# Altium schematic sheet -NEW_AQB-5-ANTON_TRANS-PWR-TVS.SchDoc
size B; Organization: AQRONOS; Address1: 12789 Emerson St.; Address2: Thornton, CO  80021; Address3: USA
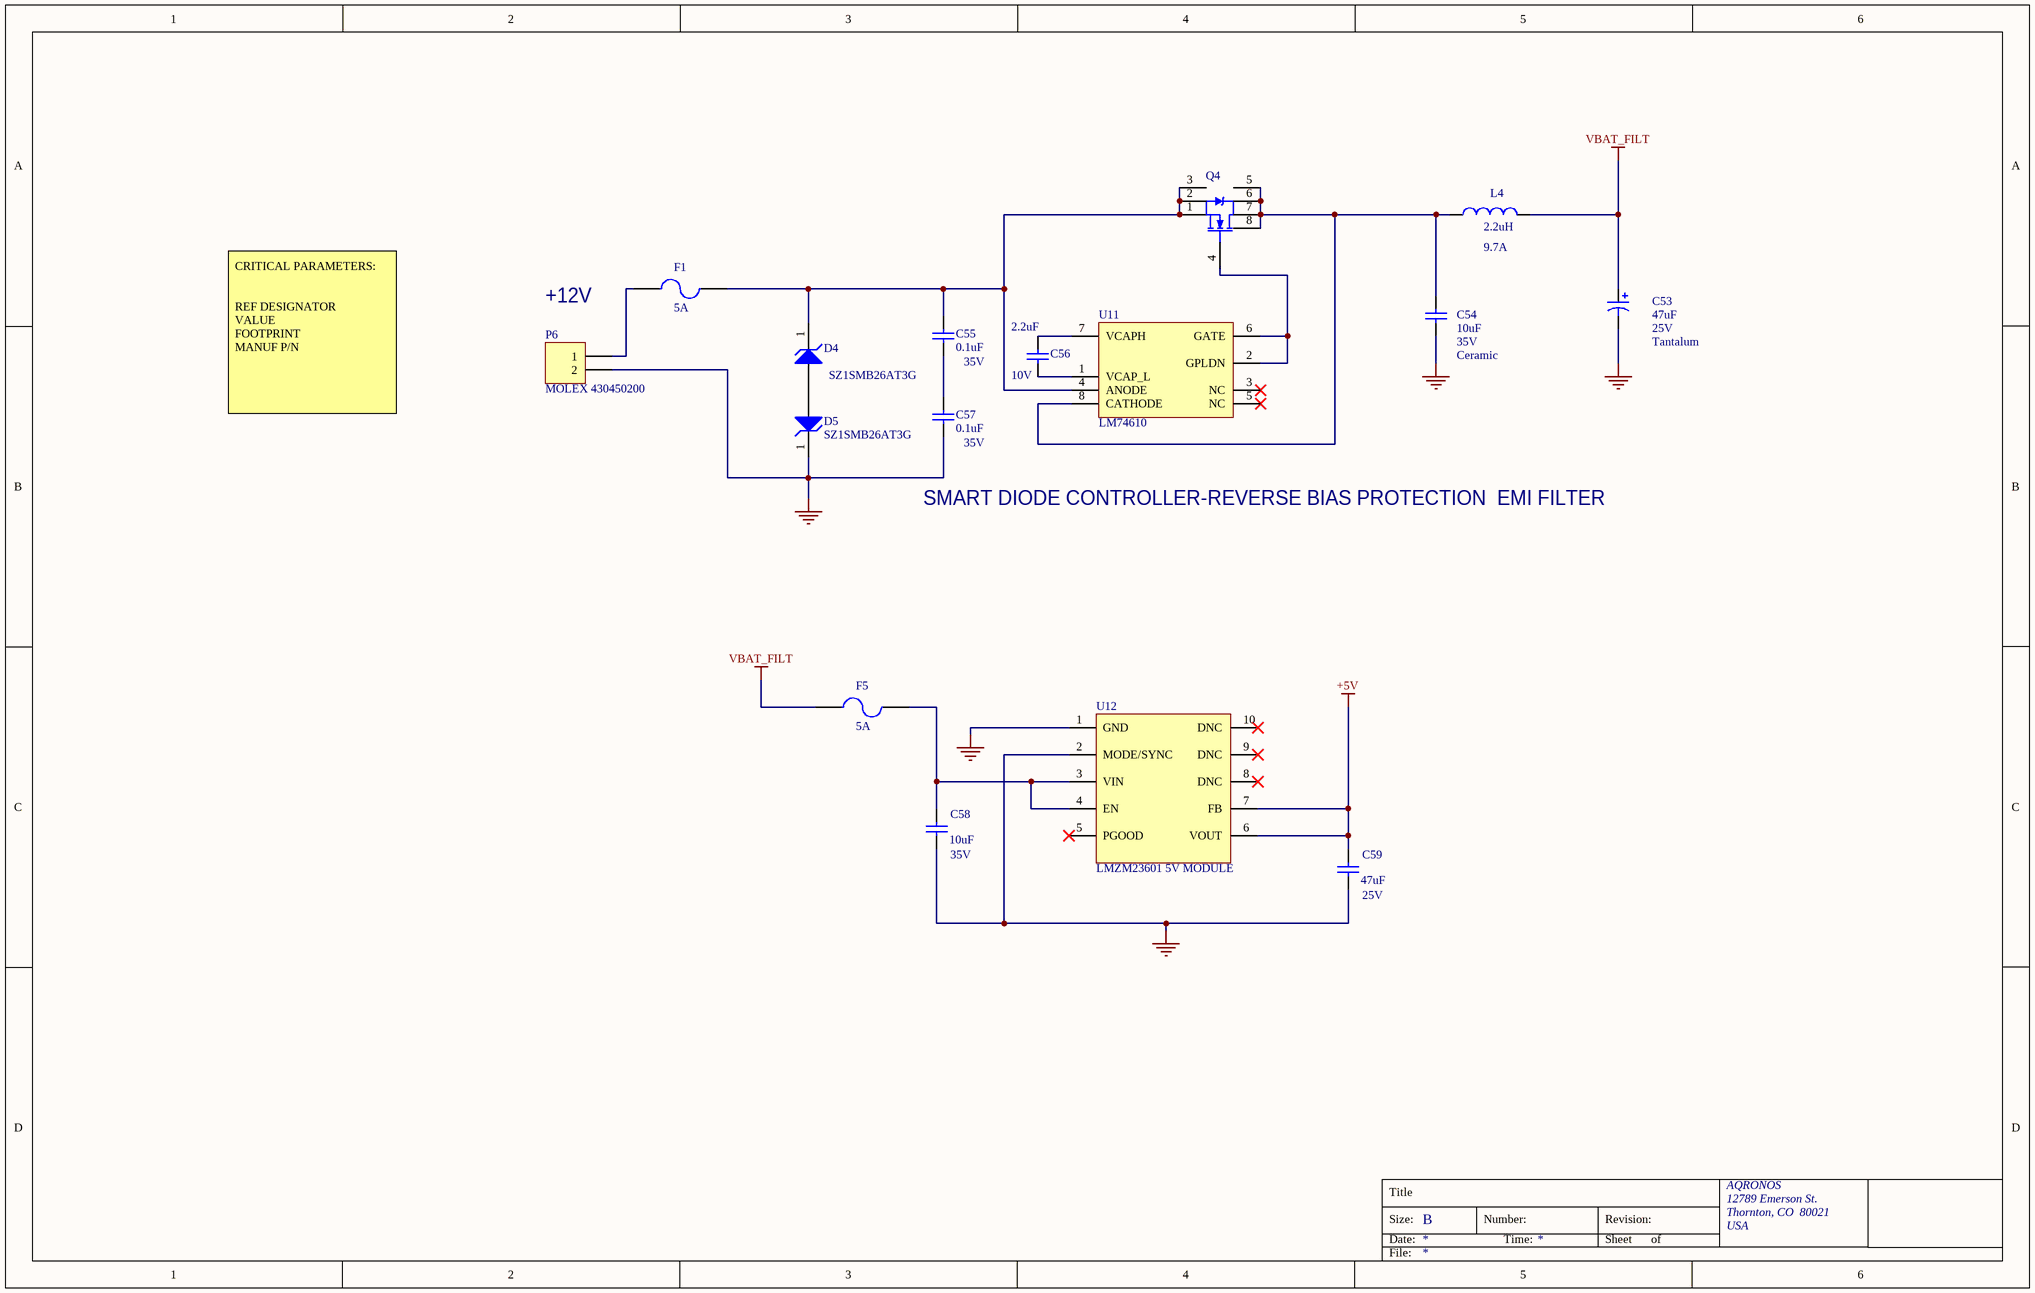
[diagram p0: -NEW_AQB-5-ANTON_TRANS-PWR-TVS.SchDoc]

## Parts
C53  Tantalum  value 47uF  Voltage: 25V  [C2917]
C54  Ceramic  value 10uF  Voltage: 35V  [CAP1206]
C55  value 0.1uF  Voltage: 35V  [CAP0603]  (hidden comment: Capacitor_non_pol)
C56  value 2.2uF  Voltage: 10V  [CAP0603]  (hidden comment: Capacitor_non_pol)
C57  value 0.1uF  Voltage: 35V  [CAP0603]  (hidden comment: Capacitor_non_pol)
C58  value 10uF  Voltage: 35V  [CAP1206]  (hidden comment: Capacitor_non_pol)
C59  value 47uF  Voltage: 25V  [CAP1206]  (hidden comment: Capacitor_non_pol)
D4  Manufacturer Part Number: SZ1SMB26AT3G  (hidden comment: Diode Zener)
D5  Manufacturer Part Number: SZ1SMB26AT3G  (hidden comment: Diode Zener)
F1  Current: 5A  [RES0603]  (hidden comment: Fuse)
F5  Current: 5A  [RES0603]  (hidden comment: Fuse)
L4  value 2.2uH  Current: 9.7A  (hidden comment: Inductor)
P6  MOLEX 430450200  [RA-HDR1X2]
Q4  CSD18531Q5A  (value not drawn)
U11  LM74610  [8-TSSOP-VSSOP]
U12  LMZM23601 5V MODULE

## Nets
+5V: C59.1 U12.6(VOUT) U12.7(FB)
GND: C53.2 C54.2 C57.1 C58.2 C59.2 D5.1(K) P6.2 U12.1(GND) U12.2(MODE/SYNC)
VBAT_FILT: C53.1 F5.1 L4.2
NetC54_1: C54.1 L4.1 Q4.5(D) Q4.6(D) Q4.7(D) Q4.8(D) U11.8(CATHODE)
NetC55_1: C55.1 C57.2
NetC55_2: C55.2 D4.1(K) F1.2 Q4.1(S) Q4.2(S) Q4.3(S) U11.4(ANODE)
NetC56_1: C56.1 U11.1(VCAP_L)
NetC56_2: C56.2 U11.7(VCAPH)
NetC58_1: C58.1 F5.2 U12.3(VIN) U12.4(EN)
NetD4_2: D4.2(A) D5.2(A)
NetF1_1: F1.1 P6.1
NetQ4_4: Q4.4(G) U11.2(GPLDN) U11.6(GATE)

Not connected (* = marked no-connect by the designer): U11 3(NC)* 5(NC)*; U12 5(PGOOD)* 8(DNC)* 9(DNC)* 10(DNC)*

## Notes on the sheet
- +12V
- CRITICAL PARAMETERS:
  REF DESIGNATOR
  VALUE
  FOOTPRINT
  MANUF P/N
- SMART DIODE CONTROLLER-REVERSE BIAS PROTECTION
- EMI FILTER
- Title
- Size:
- Date:
- B
- Number:
- Time:
- Revision:
- Sheet
- of
- File:

## Library data of the parts
C53 = Capacitor-Polarized: CAP TANT 47UF 20% 25V 2917; Manufacturer Part Number: TPSD476M025R0250; Distributor Part Number: 478-4120-1-ND; Footprint: 2917; HelpURL: *; P/N: *; Tolerance: *; Vendor: *; Current: *; Power: *; Manufacturer: *
C54 = Capacitor_non_pol: CAP CER 10UF 35V X7R 1206; Manufacturer Part Number: CGA5L1X7R1V106K160AC; Distributor Part Number: 445-174428-1-ND; Footprint: 1206; P/N: *; Tolerance: *; Vendor: *; Manufacturer: *; Power: *; Current: *
C55 C57 = Capacitor_non_pol: CAP CER 0.1UF 35V X7R 0603; Manufacturer Part Number: GMK107B7104KAHT; Distributor Part Number: 587-3354-1-ND; Footprint: 0603; P/N: *; Tolerance: *; Vendor: *; Manufacturer: *; Power: *; Current: *
C56 = Capacitor_non_pol: CAP CER 2.2UF 10V X7R 0603; Manufacturer Part Number: GRM188R71A225KE15D; Footprint: 0603; P/N: *; Tolerance: *; Vendor: *; Distributor Part Number: 490-4520-1-ND
C58 = Capacitor_non_pol: Manufacturer Part Number: C2012X5R1V106K085AC; Distributor Part Number: 445-14417-1-ND; Footprint: *; P/N: *; Tolerance: *; Vendor: *; Manufacturer: *; Power: *; Current: *
C59 = Capacitor_non_pol: Manufacturer Part Number: GRM31CR61E476ME44L; Distributor Part Number: 490-16268-1-ND; Footprint: *; P/N: *; Tolerance: *; Vendor: *; Manufacturer: *; Power: *; Current: *
D4 D5 = Diode Zener: TVS DIODE 26V 42.1V SMB; Published: 8-Jun-2000; LatestRevisionDate: 17-Jul-2002; LatestRevisionNote: Re-released for DXP Platform.; PackageReference: DIODE-0.7; Publisher: Altium Limited; Distributor Part Number: F11556CT-ND; Vendor: *; Voltage: *; Power: *; Current: *; Tolerance: *; Manufacturer: *; Footprint: DO-214AA SMB
F1 F5 = Fuse: FUSE BOARD MNT 5A 32VAC/VDC 0603; Manufacturer Part NUmber: TR/0603FA5-R; Manufacturer: Eaton; Published: 8-Jun-2000; LatestRevisionDate: 17-Jul-2002; LatestRevisionNote: Re-released for DXP Platform.; PackageReference: PIN-W2/E2.8; Publisher: Altium Limited; Vendor: *; Distributor Part Number: 283-2564-1-ND; Voltage: *; Power: *; Tolerance: *; Footprint: 0603
L4 = Inductor: Fixed Inductor 2.2uH 20% 9.7A 14.5mOhms AEC-Q200; Manufacturer: Coilcraft; Manufacturer Part Number: XAL5030-222MEB; Vendor: Mouser; Distributor Part Number: 994-XAL5030-222MEB; HelpURL: *; Tolerance: 20%; Voltage: *; Power: *
P6 = HDR1x2-430450200: Connector Header Through Hole, Right Angle 2 position; Manufacturer Part Number: 0430450200; Footprint: RA-HDR1x2; P/N: *; Tolerance: *; Value: *; Vendor: Molex; Distributor Part Number: WM1813-ND
Q4 = CSD18531Q5A: N-Channel 2.5V (G-S) MOSFET; Rule: PcbType=ProtelPcb; Published: 8-Jun-2000; LatestRevisionDate: 17-Jul-2002; LatestRevisionNote: Re-released for DXP Platform.; DatasheetVersion: 6-Oct-1997; PackageVersion: Aug-1998; PackageReference: TSOP-6; Publisher: Altium Limited; PackageDescription: SOT-457/SC-74; 6 Leads; Body 3.1 x 3 mm, inc. leads (LxW max); ComponentLink1Description: Manufacturer Link; ComponentLink1URL: http://www.vishay.com/; ComponentLink2Description: Datasheet; ComponentLink2URL: http://www.vishay.com/docs/70192/70192.pdf; Manufacturer Part Number: CSD18531Q5A; Distributor Part Number: 296-30573-1-ND; Footprint: TDFN-8
U11 = LM74610: IC SMART DIODE CTLR 8VSSOP; Manufacturer: Texas Instruments; Manufacturer Part Number: LM74610QDGKRQ1; Vendor: *; Distributor Part Number: 296-43067-1-ND; Power: *; Voltage: *; Footprint: 8-TSSOP, 8-MSOP (0.118", 3.00mm Width); Value: *; Tolerance: *
U12 = LMZM23601 5V MODULE: Manufacturer Part Number: LMZM23601V3SILT; Designator: U12; Distributor Part Number: 296-49461-1-ND; Footprint: 10-LDFN EXPOSED PAD